# EAGLE schematic Receiver (EAGLE 9.7.0)
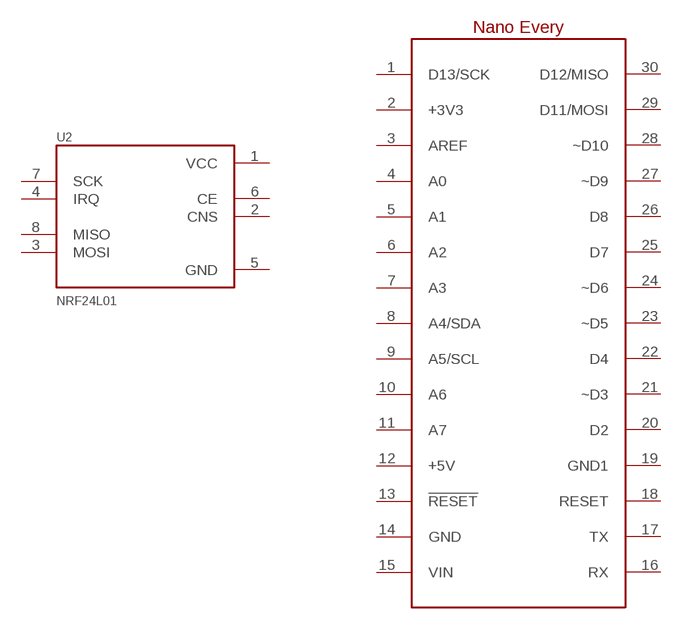
[diagram p0: schematic, sheet 1]

## Parts
U1  ARDUINONANO  [NANO]
U2  NRF24L01  [NRF24L01]
Unconnected: U1.1(D13/SCK) U1.3(AREF) U1.4(A0) U1.5(A1) U1.6(A2) U1.7(A3) U1.8(A4/SDA) U1.9(A5/SCL) U1.10(A6) U1.11(A7) U1.13(!RESET) U1.16(RX) U1.17(TX) U1.18(RESET) U1.20(D2) U1.21(~D3) U1.22(D4) U1.23(~D5) U1.24(~D6) U1.25(D7) U1.26(D8) U1.27(~D9) U1.28(~D10) U1.29(D11/MOSI) U1.30(D12/MISO) U2.2(CNS) U2.3(MOSI) U2.4(IRQ) U2.6(CE) U2.7(SCK) U2.8(MISO)

## Power pins joined to a net without a drawn wire
+3V3: U1.2(+3V3)
+5V: U1.12(+5V)
GND: U1.14(GND) U2.5(GND)
GND1: U1.19(GND1)
VCC: U2.1(VCC)
VIN: U1.15(VIN)

## Library data of the parts
U1 = Arduino Nano:ARDUINONANO: ATmega4809 Arduino Nano Every AVR AVR MCU 8-Bit Embedded Evaluation Board; MANUFACTURER: Arduino; PARTREV: 6-11-19; STANDARD: Manufacturer Recommendations
U2 = nRF24L01:NRF24L01: MakerFocus 4pcs ESP8266 ESP-01 Serial Wireless WiFi Transceiver Receiver Module 1MB SPI Flash DC3.0-3.6V Internet of Things WiFi Module Board Compatible with Ar duino; MANUFACTURER: AI-Thinker; MAXIMUM_PACKAGE_HEIGHT: 11.2 mm; PARTREV: V1.2; STANDARD: Manufacturer recommendations or IPC 7351B